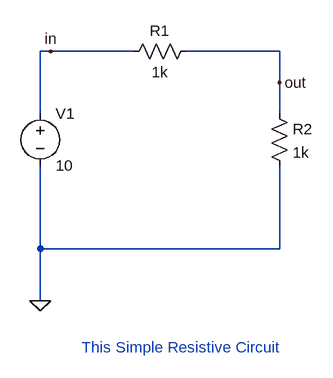
[diagram p0: schematic Chigozirim's First Resistive Circuit.asc]
Chigozirim's First Resistive Circuit.asc, the LTspice schematic file:
Version 4
SHEET 1 880 680
WIRE -48 -16 -64 -16
WIRE 80 -16 -48 -16
WIRE 304 -16 160 -16
WIRE 304 32 304 -16
WIRE -64 80 -64 -16
WIRE 304 80 304 32
WIRE -64 288 -64 160
WIRE 304 288 304 160
WIRE 304 288 -64 288
WIRE -64 368 -64 288
FLAG -64 368 0
FLAG 304 32 out
FLAG -48 -16 in
SYMBOL res 176 -32 R90
WINDOW 0 0 56 VBottom 2
WINDOW 3 32 56 VTop 2
SYMATTR InstName R1
SYMATTR Value 1k
SYMBOL voltage -64 64 R0
WINDOW 123 0 0 Left 0
WINDOW 39 0 0 Left 0
SYMATTR InstName V1
SYMATTR Value 10
SYMBOL res 288 64 R0
SYMATTR InstName R2
SYMATTR Value 1k
TEXT 0 440 Left 2 ;This Simple Resistive Circuit

The netlist it stands for:
* Chigozirim's First Resistive Circuit.asc
R1 out in 1k
V1 in 0 10
R2 out 0 1k
* This Simple Resistive Circuit
.backanno
.end